# Altium schematic sheet MotionMicrophone.SchDoc
size A4
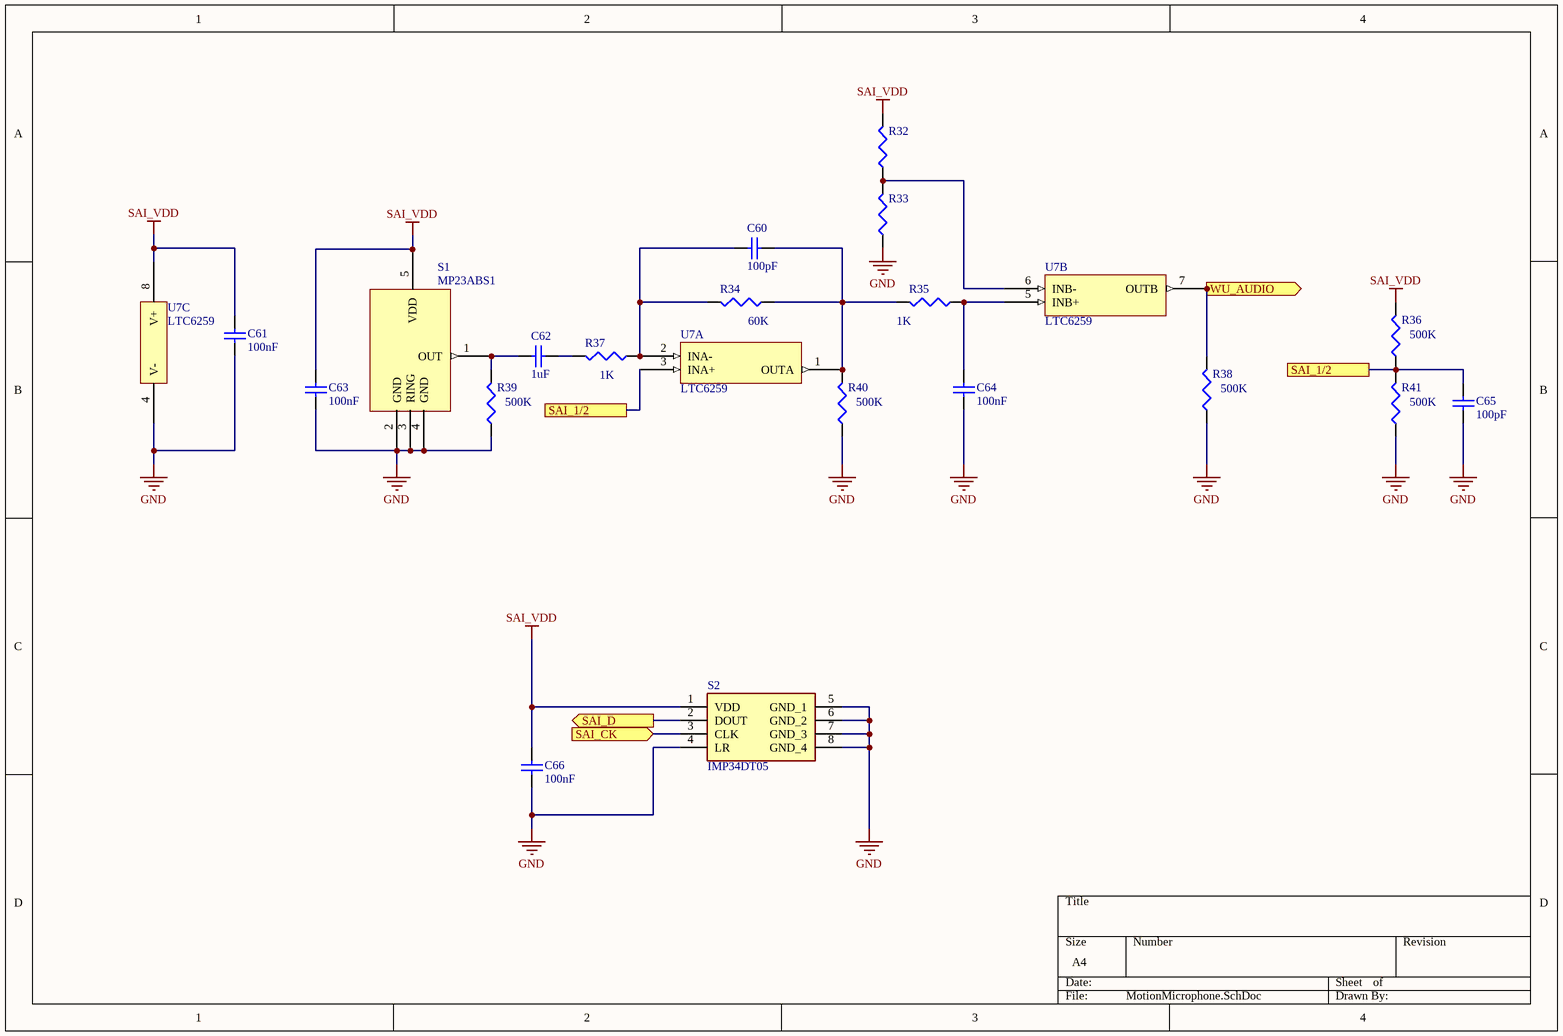
[diagram p0: MotionMicrophone.SchDoc]

## Parts
C60  100pF  [CAPC1608X90X35NL10T15]
C61  100nF  [CAPC1608X90X35NL10T15]
C62  1uF  [CAPC1608X90X35NL10T15]
C63  100nF  [CAPC1608X90X35NL10T15]
C64  100nF  [CAPC1608X90X35NL10T15]
C65  100pF  [CAPC1608X90X35NL10T15]
C66  100nF  [CAPC1608X90X35NL10T15]
R32  (no value)  [J1-0603]
R33  (no value)  [J1-0603]
R34  value 60K  [J1-0603]
R35  value 1K  [J1-0603]
R36  value 500K  [J1-0603]
R37  value 1K  [J1-0603]
R38  value 500K  [J1-0603]
R39  value 500K  [J1-0603]
R40  value 500K  [J1-0603]
R41  value 500K  [J1-0603]
S1  MP23ABS1  [MP23ABS1]
S2  IMP34DT05  [IMP34DT05]
U7  LTC6259  [SOT23-8]  (parts A,B,C of 3)

## Ports
SAI_1/2, SAI_CK (in), SAI_D (out), WU_AUDIO (out)

## Nets
GND: C61.1 C63.1 C64.1 C65.2 C66.1 R33.1 R38.1 R39.1 R40.1 R41.1 S1.2(GND) S1.3(RING) S1.4(GND) S2.4(LR) S2.5(GND_1) S2.6(GND_2) S2.7(GND_3) S2.8(GND_4) U7.4(V-)
SAI_VDD: C61.2 C63.2 C66.2 R32.2 R36.2 S1.5(VDD) S2.1(VDD) U7.8(V+)
SAI_1/2: C65.1 R36.1 R41.2 U7.3(INA+) ; port SAI_1/2
SAI_CK: S2.3(CLK) ; port SAI_CK
SAI_D: S2.2(DOUT) ; port SAI_D
WU_AUDIO: R38.2 U7.7(OUTB) ; port WU_AUDIO
NetC60_1: C60.1 R34.1 R35.2 R40.2 U7.1(OUTA)
NetC60_2: C60.2 R34.2 R37.1 U7.2(INA-)
NetC62_1: C62.1 R37.2
NetC62_2: C62.2 R39.2 S1.1(OUT)
NetC64_2: C64.2 R35.1 U7.5(INB+)
NetR32_1: R32.1 R33.2 U7.6(INB-)

## Library data of the parts
C60-C66 = CMP-2006-02891-1: Part Number: GRM188R71H102KA01D; Manufacturer: Murata
R32-R41 = Res3: Resistor; Published: 8-Jun-2000; LatestRevisionDate: 29-May-2009; LatestRevisionNote: IPC-7351 Footprint Added.; PackageReference: J1-0603; Publisher: Altium Limited; PackageDescription: Chip Resistor
S2 = IMP34DT05: Integrated Circuit; Manufacturer_Name: STMicroelectronics; Datasheet Link: https://www.st.com/resource/en/datasheet/imp34dt05.pdf; Height: 1.1mm; Manufacturer_Part_Number: IMP34DT05; Mouser Part Number: N/A; Mouser Price/Stock: https://www.mouser.com/Search/Refine.aspx?Keyword=N%2FA